# Altium schematic sheet KeyBoard.SchDoc
size A4
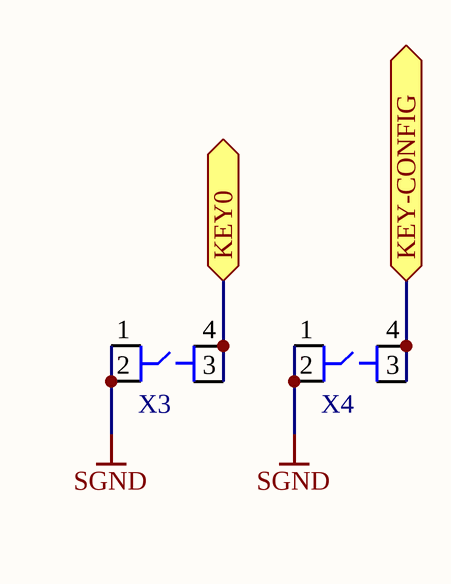
[diagram p0: KeyBoard.SchDoc]

## Parts
X3  TACT0606  [TACT0606]  (value not drawn)
X4  TACT0606  [TACT0606]  (value not drawn)

## Ports
KEY0, KEY-CONFIG

## Nets
SGND: X3.1 X3.2 X4.1 X4.2
KEY0: X3.3 X3.4 ; port KEY0
KEY-CONFIG: X4.3 X4.4 ; port KEY-CONFIG

## Library data of the parts
X3 X4 = TACT0606: Tact switch 6x6mm; Name: TACT0606; Type: Кнопка